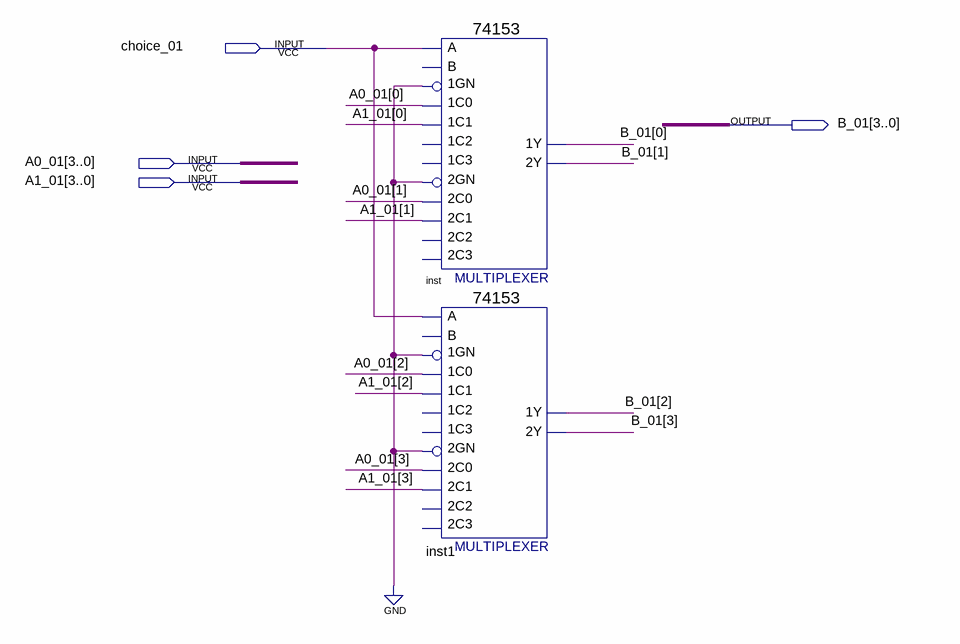
[diagram p0: schematic sheet]
// Quartus schematic sys_choice.bdf as structural Verilog: 2 symbols, 4 pins
module sys_choice (
  input  choice_01,
  input  [3:0] A0_01,
  input  [3:0] A1_01,
  output [3:0] B_01
);

  \74153  inst (
    .\1C1 (A1_01[0]), .\1GN (1'b0), .\1C0 (A0_01[0]), .\2C0 (A0_01[1]), .\2GN (1'b0), .A(choice_01),
    .\2C1 (A1_01[1]), .\1Y (B_01[0]), .\2Y (B_01[1]));  // open: 2C2, 1C2, 1C3, B, 2C3
  \74153  inst1 (
    .\1C1 (A1_01[2]), .\1GN (1'b0), .\1C0 (A0_01[2]), .\2C0 (A0_01[3]), .\2GN (1'b0), .A(choice_01),
    .\2C1 (A1_01[3]), .\1Y (B_01[2]), .\2Y (B_01[3]));  // open: 2C2, 1C2, 1C3, B, 2C3
endmodule
